# EAGLE design 555-blinker (EAGLE 7.5.0)
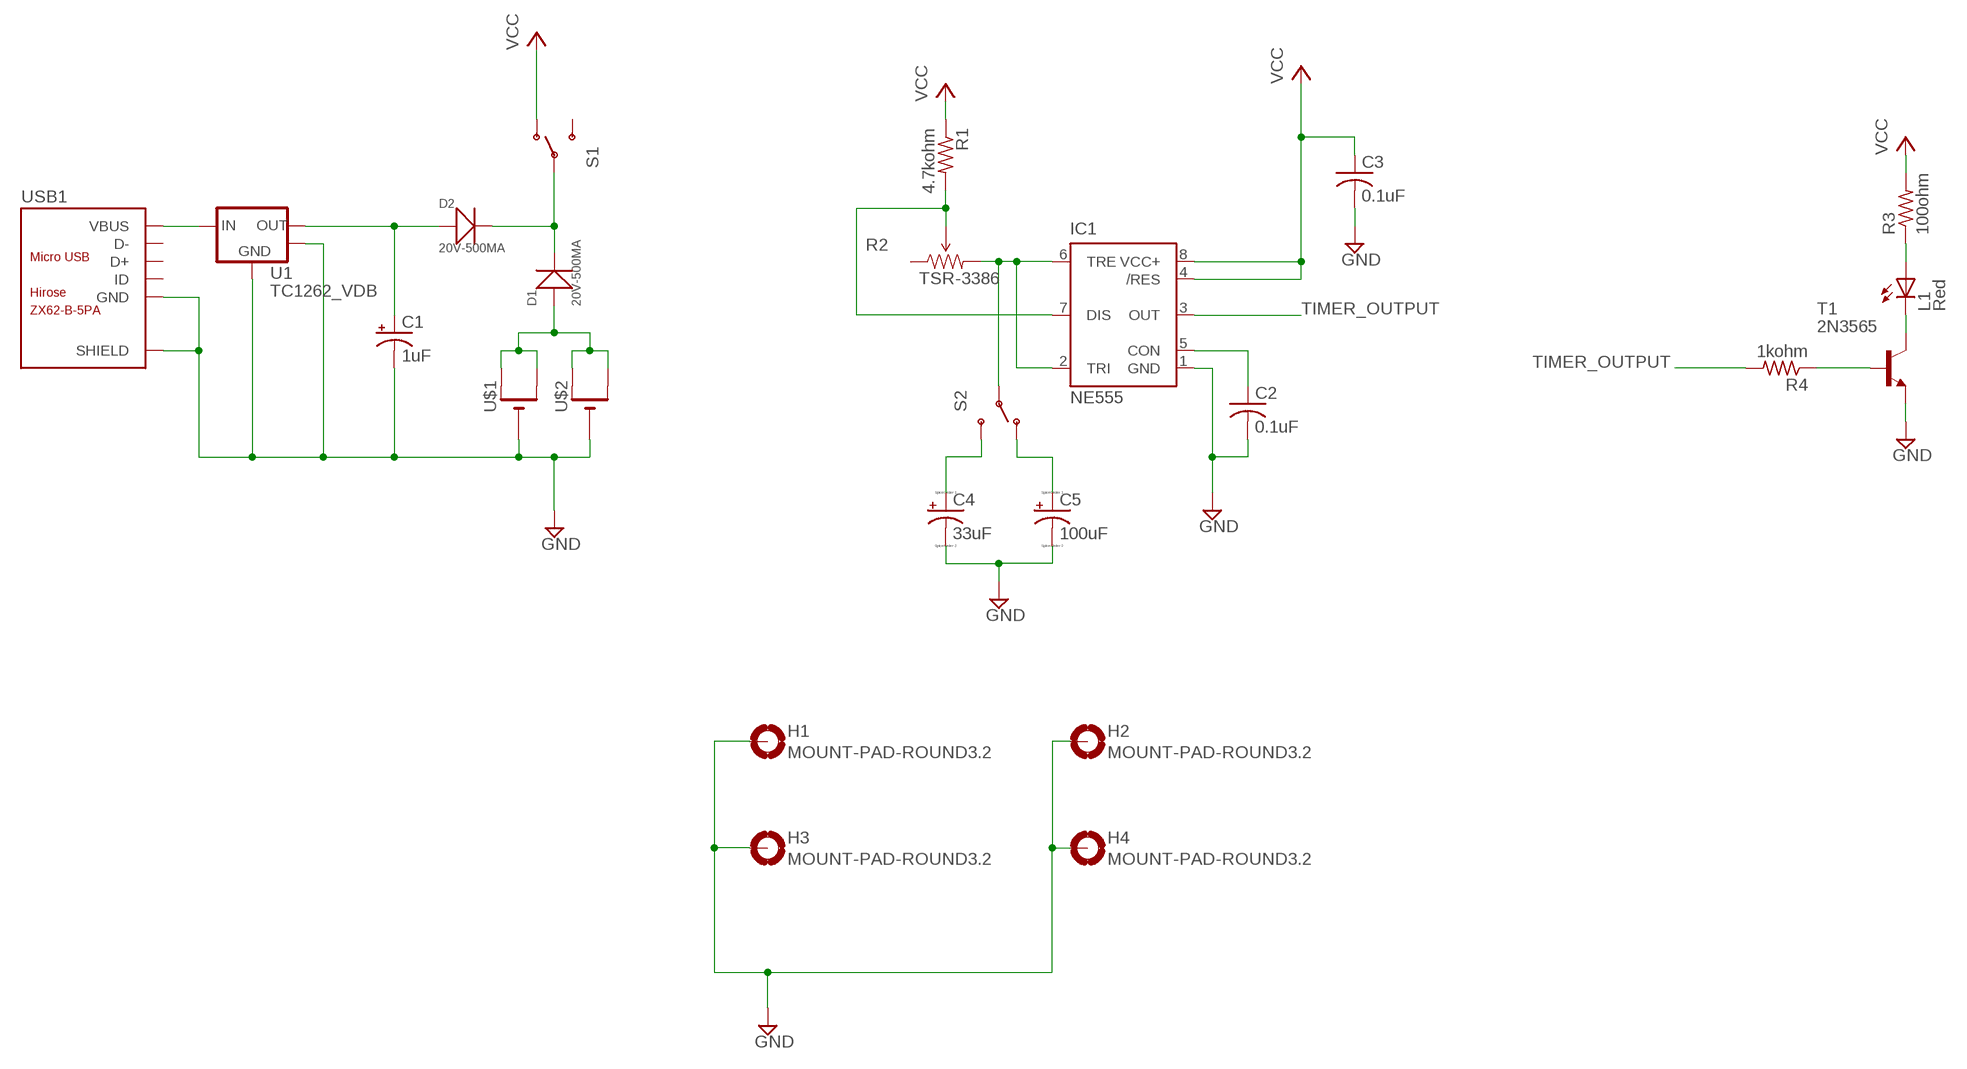
[diagram p0: schematic, sheet 1]

## Parts
C1  1uF  CPOL-USUD-4X5,8  [UD-4X5,8_NICHICON]
C2  0.1uF  C-US025-025X050  [C025-025X050]
C3  0.1uF  C-US025-025X050  [C025-025X050]
C4  33uF  CPOL-USE2-5  [E2-5]
C5  100uF  CPOL-USE2-5  [E2-5]
D1  20V-500MA  SMD-DIODE-SCHOTTKY-20V-500MA(SOD-123)  [SOD-123]
D2  20V-500MA  SMD-DIODE-SCHOTTKY-20V-500MA(SOD-123)  [SOD-123]
H1  MOUNT-PAD-ROUND3.2  [3,2-PAD]
H2  MOUNT-PAD-ROUND3.2  [3,2-PAD]
H3  MOUNT-PAD-ROUND3.2  [3,2-PAD]
H4  MOUNT-PAD-ROUND3.2  [3,2-PAD]
IC1  NE555  [DIL-08]
L1  Red  LED5MM  [LED5MM]
R1  4.7kohm  R-US_0207/10  [0207/10]
R2  TSR-3386  TRIMPOT-PTH-KNOB  [3386U]
R3  100ohm  R-US_0207/10  [0207/10]
R4  1kohm  R-US_0207/10  [0207/10]
S1  SWITCH-SPDTPTH  [SWITCH-SPDT]
S2  SWITCH-SPDTPTH  [SWITCH-SPDT]
T1  2N3565  [TO92]
U1  TC1262_VDB  [SOT-223-3]
U$1  CR2032SMT  [CR2032-SMD]
U$2  CR2032SMT  [CR2032-SMD]
USB1  ZX62-B-5PA  MICRO-USB-SMD(ZX62-B-5PA)  [MICRO-USB5+6P-SMD-0.65-AB]

## Nets
GND: C1.- C2.2 C3.2 C4.- C5.- H1.B3,2(MOUNT) H2.B3,2(MOUNT) H3.B3,2(MOUNT) H4.B3,2(MOUNT) IC1.1(GND) T1.3(E) U1.2(GND) U1.4(TAB) U$1.- U$2.- USB1.5(GND) USB1.P1(SHIELD) USB1.P2(SHIELD) USB1.P3(SHIELD) USB1.P4(SHIELD) USB1.P5(SHIELD) USB1.P6(SHIELD)
N$1: C1.+ D2.+ U1.3(VOUT)
N$2: D1.+ U$1.+$1(+) U$1.+$2(+1) U$2.+$1(+) U$2.+$2(+1)
N$3: C2.1 IC1.5(CON)
N$4: D1.- D2.- S1.2(P)
N$5: IC1.7(DIS) R1.2 R2.2(WIPER)
N$6: L1.K(C) T1.1(C)
N$7: L1.A R3.1
N$8: IC1.2(TRI) IC1.6(TRE) R2.3(CW) S2.2(P)
N$9: R4.1 T1.2(B)
N$10: C4.+ S2.3(S)
N$11: C5.+ S2.1(O)
TIMER_OUTPUT: IC1.3(OUT) R4.2
VBUS: U1.1(VIN) USB1.1(VBUS)
VCC: C3.1 IC1.4(/RES) IC1.8(VCC+) R1.1 R3.2 S1.1(O)
Unconnected: R2.1(CCW) S1.3(S) USB1.2(D-) USB1.3(D+) USB1.4(ID)

## Library data of the parts
C1 = rcl:CPOL-US: POLARIZED CAPACITOR, American symbol
C2 C3 = rcl:C-US: CAPACITOR, American symbol
C4 C5 = resistor:CPOL-US: POLARIZED CAPACITOR, American symbol
D1 D2 = Seeed-OPL-Diode:SMD-DIODE-SCHOTTKY-20V-500MA(SOD-123): 304020028; MPN: MBR0520LT1G
H1-H4 = holes:MOUNT-PAD-ROUND: MOUNTING PAD, round
IC1 = st-microelectronics:NE555: General purpose bipolar Timer; MF: Arrow Electronics; MPN: NE555N; OC_FARNELL: 1467742; OC_NEWARK: 89K1486
L1 = led:LED: LED OSRAM: - CHIPLED LG R971, LG N971, LY N971, LG Q971, LY Q971, LO R971, LY R971 LH N974, LH R974 LS Q976, LO Q976, LY Q976 LO Q996 - Hyper CHIPLED LW Q18S LB Q993, LB Q99A, LB R99A - SideLED LS A670, LO A670, LY A670, LG A670, LP A670 LB A673, LV A673, LT A673, LW A673 LH A674 LY A675 LS A676, LA A676, LO A676, LY A676, LW A676 LS A679, LY A679, LG A679 - Hyper Micro SIDELED® LS Y876, LA Y876, LO Y876, LY Y876 LT Y87S - SmartLED LW L88C, LW L88S LB L89C, LB L89S, LG L890 LS L89K, LO L89K, LY L89K LS L896, LA L896, LO L896, LY L896 - TOPLED LS T670, LO T670, LY T670, LG T670, LP T670 LSG T670, LSP T670, LSY T670, LOP T670, LYG T670 LG T671, LOG T671, LSG T671 LB T673, LV T673, LT T673, LW T673 LH T674 LS T676, LA T676, LO T676, LY T676, LB T676, LH T676, LSB T676, LW T676 LB T67C, LV T67C, LT T67C, LS T67K, LO T67K, LY T67K, LW E67C LS E67B, LA E67B, LO E67B, LY E67B, LB E67C, LV E67C, LT E67C LW T67C LS T679, LY T679, LG T679 LS T770, LO T770, LY T770, LG T770, LP T770 LB T773, LV T773, LT T773, LW T773 LH T774 LS E675, LA E675, LY E675, LS T675 LS T776, LA T776, LO T776, LY T776, LB T776 LHGB T686 LT T68C, LB T68C - Hyper Mini TOPLED® LB M676 - Mini TOPLED Santana® LG M470 LS M47K, LO M47K, LY M47K Source: http://www.osram.convergy.de LUXEON: - LUMILED® LXK2-PW12-R00, LXK2-PW12-S00, LXK2-PW14-U00, LXK2-PW14-V00 LXK2-PM12-R00, LXK2-PM12-S00, LXK2-PM14-U00 LXK2-PE12-Q00, LXK2-PE12-R00, LXK2-PE12-S00, LXK2-PE14-T00, LXK2-PE14-U00 LXK2-PB12-K00, LXK2-PB12-L00, LXK2-PB12-M00, LXK2-PB14-N00, LXK2-PB14-P00, LXK2-PB14-Q00 LXK2-PR12-L00, LXK2-PR12-M00, LXK2-PR14-Q00, LXK2-PR14-R00 LXK2-PD12-Q00, LXK2-PD12-R00, LXK2-PD12-S00 LXK2-PH12-R00, LXK2-PH12-S00 LXK2-PL12-P00, LXK2-PL12-Q00, LXK2-PL12-R00 Source: www.luxeon.com KINGBRIGHT: KA-3528ASYC Source: www.kingbright.com
R1 R3 R4 = resistor:R-US_: RESISTOR, American symbol
R2 = SparkFun-Electromechanical:TRIMPOT: Various small potentiometers for "set-and-forget" applications; PROD_ID: RES-09730
S1 S2 = SparkFun-Electromechanical:SWITCH-SPDT: SPDT Switch Simple slide switch, Spark Fun Electronics SKU : COM-00102 DPDT SMT slide switch, AYZ0202, SWCH-08179; PROD_ID: SWCH-08261
T1 = transistor:2N3565: NPN TRANSISTOR
U1 = bt_regulator:TC1262: Microchip TC1262 LDO Regulator The TC1262 is a fixed output, high accuracy (typically ±0.5%) CMOS low dropout regulator. Designed specif- ically for battery-operated systems, the TC1262’s CMOS construction eliminates wasted ground current, significantly extending battery life. Total supply current is typically 80A at full load (20 to 60 times lower than in bipolar regulators). TC1262 key features include ultra low noise operation, very low dropout voltage (typically 350mV at full load), and fast response to step changes in load. Datasheet.pdf <http://ww1.microchip.com/downloads/en/DeviceDoc/21373C.pdf>
U$1 U$2 = cr2032-large-side:CR2032
USB1 = Seeed-OPL-Connector:MICRO-USB-SMD(ZX62-B-5PA): 320010005; MPN: ZX62-B-5PA

## Board
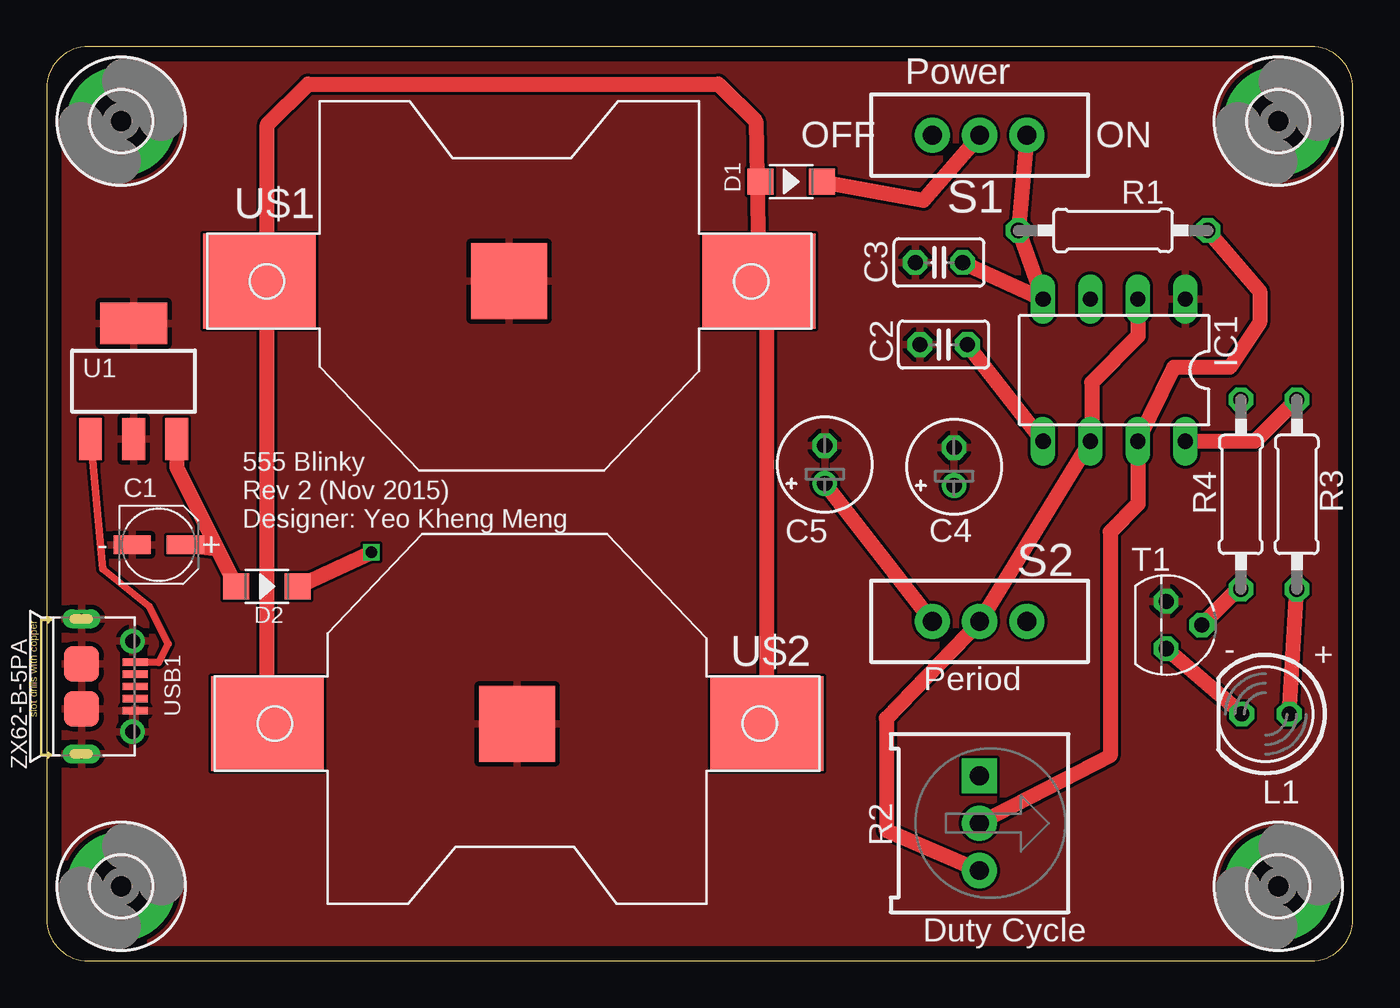
[diagram p1: board, top side]
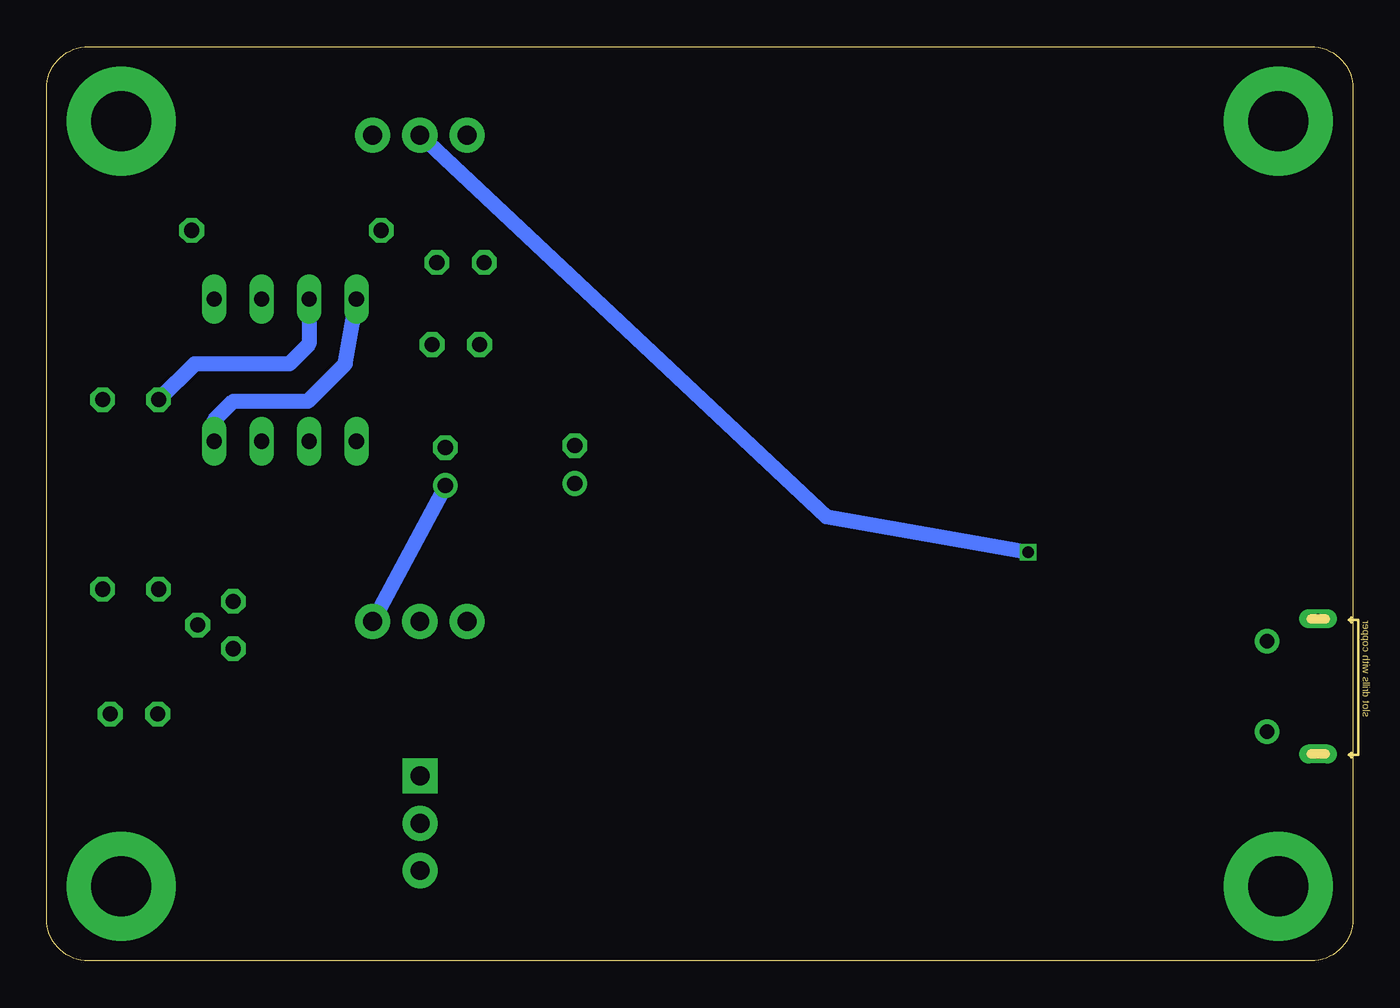
[diagram p2: board, bottom side, seen from below]

Size 70 x 49 mm. Coordinates in mm from the lower left corner, seen from the top.
Outline: 0,46.76 0,2.24 arc90 2.24,0 67.76,0 arc90 70,2.24 70,46.76 arc90 67.76,49 2.24,49 arc90 0,46.76
Copper layers (1*16): Top 0.035mm / dielectric 1.5mm / Bottom 0.035mm
Design rules "Elecrow_2-layer_eagle_rule": minimum track width 6mil, minimum drill 12mil, track to track 6mil, track to pad 6mil, pad to pad 6mil, via to via 6mil, smd to smd 0mil, copper to edge 10mil, drill to drill 10mil, minimum pad ring 10mil, minimum via ring 6mil, stop-mask expansion 2mil, vias tented up to drill 100mil, thermal gap 10mil

### Footprints (pad centres in the part's own frame; a part is rotated, then mirrored left to right if it is on the bottom)
UD-4X5,8_NICHICON = smd 2 x 1: + 1.425,0; - -1.425,0
C025-025X050 = drill 0.813 octagon: 1 -1.27,0; 2 1.27,0
E2-5 = drill 0.813 pad 1.27: + -1.016,0 | drill 0.813 pad 1.27 octagon: - 1.016,0
SOD-123 = smd 1.397 x 1.397: + -1.651,0; - 1.651,0
3,2-PAD = drill 3.2 pad 5.842: B3,2 0,0
DIL-08 = drill 0.813 long: 1 -3.81,-3.81; 2 -1.27,-3.81; 3 1.27,-3.81; 4 3.81,-3.81; 5 3.81,3.81; 6 1.27,3.81; 7 -1.27,3.81; 8 -3.81,3.81
LED5MM = drill 0.813 octagon: A -1.27,0; K 1.27,0
0207/10 = drill 0.813 octagon: 1 -5.08,0; 2 5.08,0
3386U = drill 1.016 pad 1.88 square: 1 -2.54,-0.015 | drill 1.016 pad 1.88: 2 0,-0.015; 3 2.54,-0.015
SWITCH-SPDT = drill 1.016 pad 1.88: 1 0,2.54; 2 0,0; 3 0,-2.54
TO92 = drill 0.813 octagon: 1 1.27,0; 2 0,1.905; 3 -1.27,0
SOT-223-3 = smd 1.219 x 2.235: 1 -2.311,-3.099; 2 0,-3.099; 3 2.311,-3.099 | smd 3.6 x 2.2: 4 0,3.099
CR2032-SMD = smd 6.04 x 5.08: +$1 -13.39,0; +$2 13.38,0 | smd 4.064 x 4.064: - 0,0
MICRO-USB5+6P-SMD-0.65-AB = smd 0.4 x 1.35: 1 -1.3,2.875; 2 -0.65,2.875; 3 0,2.875; 4 0.65,2.875; 5 1.3,2.875 | smd 1.9 x 1.9: P1 -1.2,0; P2 1.2,0 | drill 0.508 pad 1.016 long: P3 -3.625,0; P4 3.625,0 | drill 0.8: P5 -2.425,2.73; P6 2.425,2.73

### Placement (x,y rotation side)
C1  6.01,22.3 0 top
C2  48.07,33.03 180 top
C3  47.82,37.43 180 top
C4  48.63,26.49 90 top
C5  41.7,26.6 90 top
D1  39.9,41.77 0 top
D2  11.81,20.07 0 top
H1  4,45 0 top
H2  4,4 0 top
H3  66,4 0 top
H4  66,45 0 top
IC1  57.21,31.66 180 top
L1  65.32,13.23 180 top
R1  57.15,39.15 0 top
R2  50,7.38 270 top
R3  67,25 90 top
R4  64,25 90 top
S1  50,44.26 270 top
S2  50,18.2 90 top
T1  60,18 270 top
U1  4.66,31.07 0 top
U$1  24.79,36.43 0 top
U$2  25.21,12.71 180 top
USB1  1.87,14.71 270 top

### Tracks (layer width: path | path; a pad name or v marks a point on that pad's centre or on a via)
GND
  pour Top: 1,48 69,48 69,1 1,1
N$1
  Top 0.813: U1.3 6.97,26.46 9.16,22.08 | 9.16,22.08 D2.+ | C1.+ 9.16,22.08
N$2
  Top 0.61: 11.83,36 U$1.+$1
  Top 0.813: U$2.+$2 11.83,36 11.83,44.83 14,47 36,47 38,45 38.06,42 | U$2.+$1 38.6,36 U$1.+$2 38.06,42 | D1.+ 38.06,42
N$3
  Top 0.813: IC1.5 C2.1
N$4  (via drill 0.6)
  Top 0.813: D1.- 46.99,40.77 S1.2 | D2.- v17.4,21.9
  Bottom 0.813: v17.4,21.9 28.22,23.8 S1.2
N$5
  Top 0.813: R1.2 65,35.9 65,34.2 63.4,31.8 60.4,31.8 IC1.7 58.48,24.48 57,23 57,11 R2.2
N$6
  Top 0.813: T1.1 L1.K
N$7
  Top 0.813: L1.A R3.1
N$8
  Top 0.813: IC1.2 58.48,33.48 56,31 56,27.91 IC1.6 S2.2 45,13 45,7 R2.3
N$9
  Top 0.813: R4.1 63.83,19.92 T1.2
N$10
  Bottom 0.813: C4.+ S2.3
N$11
  Top 0.813: S2.1 C5.+
TIMER_OUTPUT
  Bottom 0.813: IC1.3 55.94,33.06 57,32 62.08,32 R4.2
VBUS
  Top 0.406: U1.1 3,21 5.5,19 6.5,17 6,16 USB1.1
VCC
  Top 0.813: C3.1 IC1.4 R1.1 S1.1 | IC1.8 64.77,27.85 R3.2
  Bottom 0.813: IC1.8 61.02,28.98 60,30 56,30 54,32 IC1.4

### Text on the board
tPlace: Power | OFF | ON | 555 Blinky / Rev 2 (Nov 2015) / Designer: Yeo Kheng Meng | - | + | - | + | Period | Duty Cycle